# EAGLE design booster002 (EAGLE 4.16)
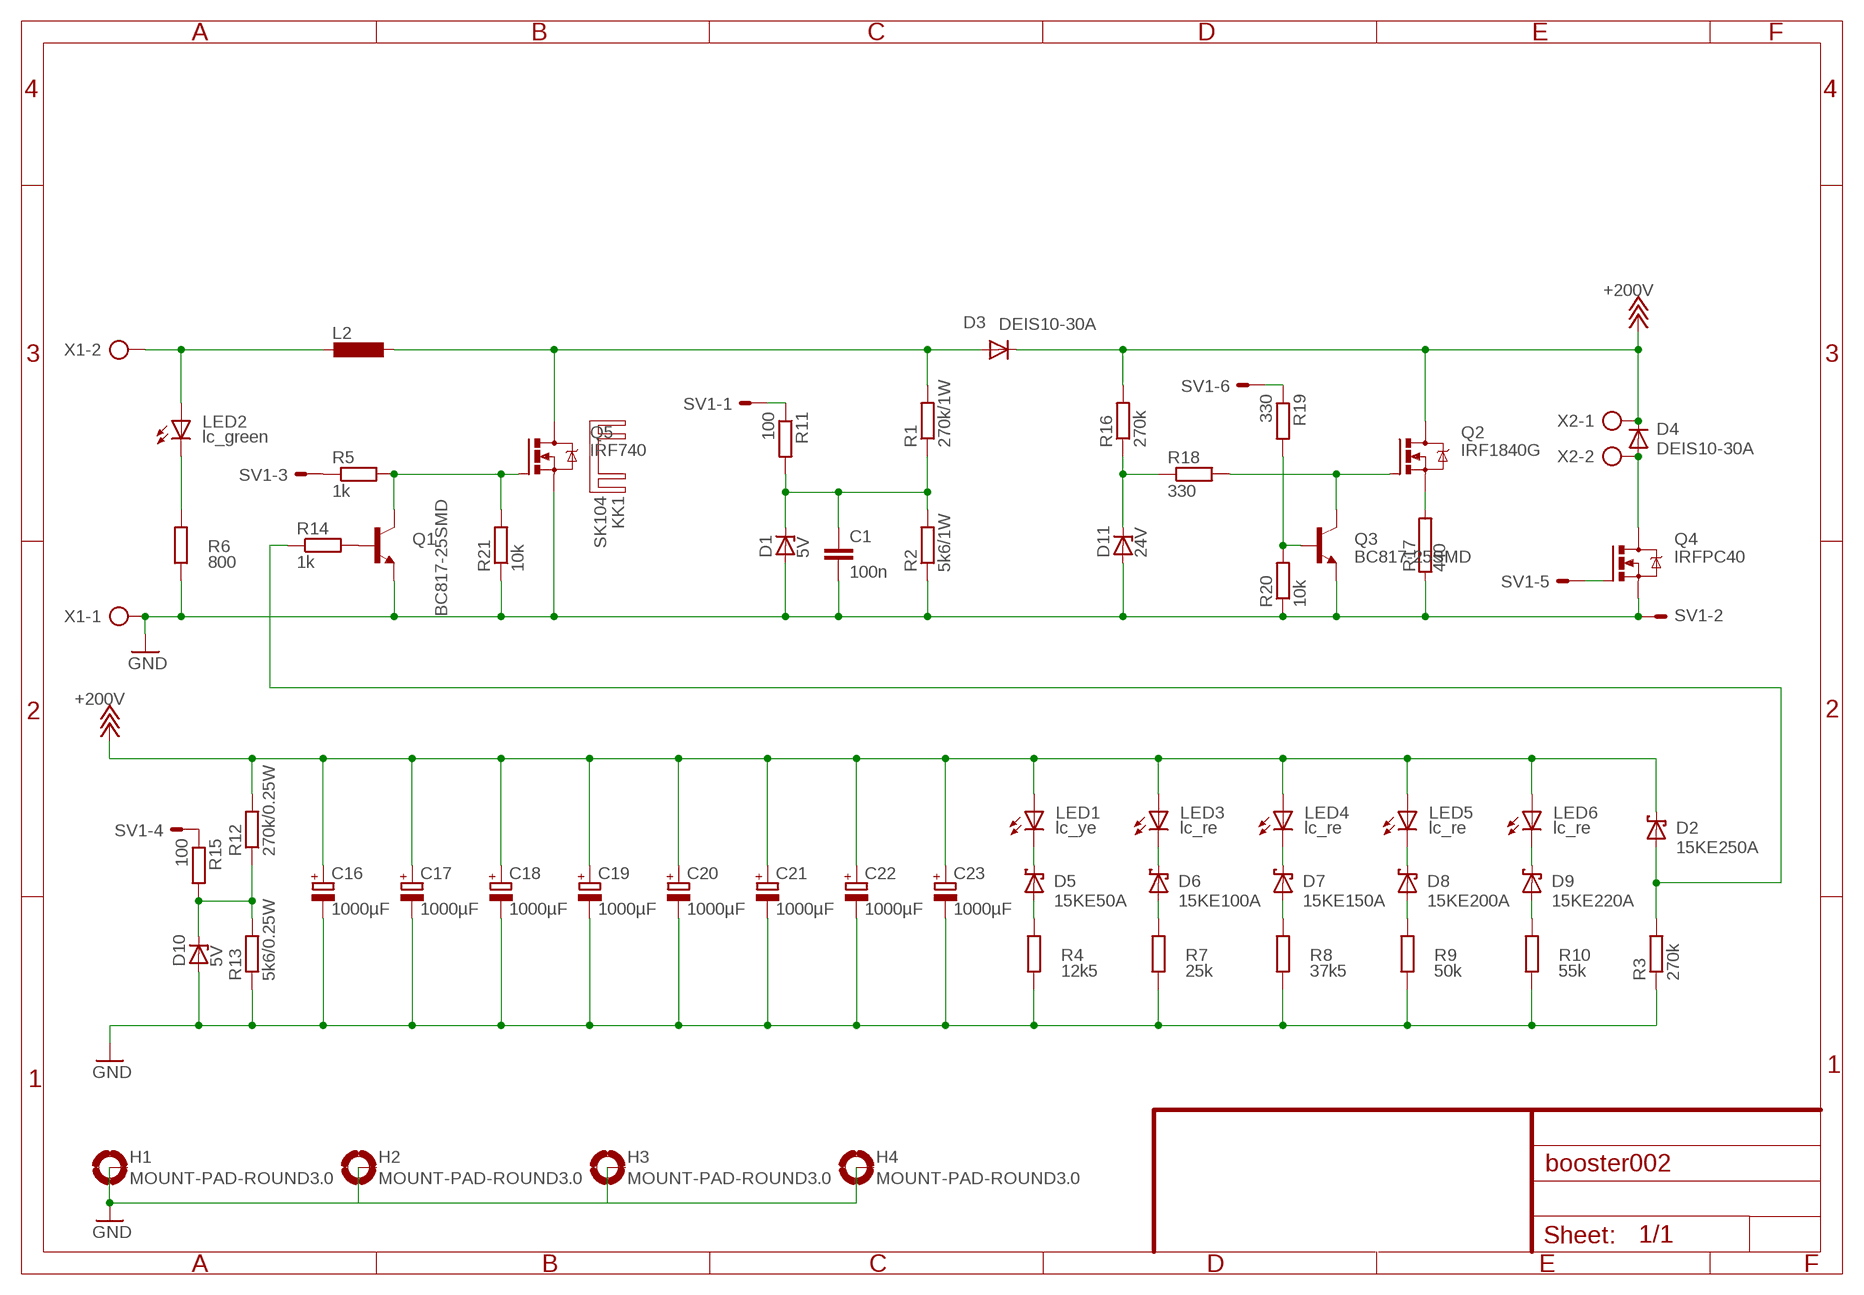
[diagram p0: schematic, sheet 1]

## Parts
C1  100n  C-EUC0603  [C0603]
C16  1000µF  CPOL-EUE10-35  [EB35D]
C17  1000µF  CPOL-EUE10-35  [EB35D]
C18  1000µF  CPOL-EUE10-35  [EB35D]
C19  1000µF  CPOL-EUE10-35  [EB35D]
C20  1000µF  CPOL-EUE10-35  [EB35D]
C21  1000µF  CPOL-EUE10-35  [EB35D]
C22  1000µF  CPOL-EUE10-35  [EB35D]
C23  1000µF  CPOL-EUE10-35  [EB35D]
D1  5V  ZENER-DIODESOT23  [SOT23]
D2  15KE250A  15KEXX  [CB429-17]
D3  DEIS10-30A  [TO247AD]
D4  DEIS10-30A  [TO247AD]
D5  15KE50A  15KEXX  [CB429-17]
D6  15KE100A  15KEXX  [CB429-17]
D7  15KE150A  15KEXX  [CB429-17]
D8  15KE200A  15KEXX  [CB429-17]
D9  15KE220A  15KEXX  [CB429-17]
D10  5V  ZENER-DIODESOT23  [SOT23]
D11  24V  ZENER-DIODESOT23  [SOT23]
H1  MOUNT-PAD-ROUND3.0  [3,0-PAD]
H2  MOUNT-PAD-ROUND3.0  [3,0-PAD]
H3  MOUNT-PAD-ROUND3.0  [3,0-PAD]
H4  MOUNT-PAD-ROUND3.0  [3,0-PAD]
KK1  SK104  [SK104]
L2  L-EUTJ6-U1  [TJ6-U1]
LED1  lc_ye  LED5MM  [LED5MM]
LED2  lc_green  LED5MM  [LED5MM]
LED3  lc_re  LED5MM  [LED5MM]
LED4  lc_re  LED5MM  [LED5MM]
LED5  lc_re  LED5MM  [LED5MM]
LED6  lc_re  LED5MM  [LED5MM]
Q1  BC817-25SMD  [SOT23-BEC]
Q2  IRF1840G  IRF740  [TO220BV]
Q3  BC817-25SMD  [SOT23-BEC]
Q4  IRFPC40  [TO247BV]
Q5  IRF740  [TO220BV]
R1  270k/1W  R-EU_0207/10  [0207/10]
R2  5k6/1W  R-EU_0207/10  [0207/10]
R3  270k  R-EU_R0805  [R0805]
R4  12k5  R-EU_R0805  [R0805]
R5  1k  R-EU_R0805  [R0805]
R6  800  R-EU_R0805  [R0805]
R7  25k  R-EU_R0805  [R0805]
R8  37k5  R-EU_R0805  [R0805]
R9  50k  R-EU_R0805  [R0805]
R10  55k  R-EU_R0805  [R0805]
R11  100  R-EU_R0805  [R0805]
R12  270k/0.25W  R-EU_0207/10  [0207/10]
R13  5k6/0.25W  R-EU_0207/10  [0207/10]
R14  1k  R-EU_R0805  [R0805]
R15  100  R-EU_R0805  [R0805]
R16  270k  R-EU_R0805  [R0805]
R17  440  RHS50  [HS50]
R18  330  R-EU_R0805  [R0805]
R19  330  R-EU_R0805  [R0805]
R20  10k  R-EU_R0805  [R0805]
R21  10k  R-EU_R0805  [R0805]
SV1  ML6LE  [ML6L]
X1  AK500/2-H  [AK500/2-H]
X2  AK500/2-H  [AK500/2-H]

## Nets
+200V: C16.+ C17.+ C18.+ C19.+ C20.+ C21.+ C22.+ C23.+ D2.C D3.K(C) D4.K(C) LED1.A LED3.A LED4.A LED5.A LED6.A Q2.D R12.2 R16.2 X2.1
ADC_250V: C1.1 D1.3(C) R1.1 R2.2 R11.2
ADC_250V1: D10.3(C) R12.1 R13.2 R15.2
GND [Power]: C1.2 C16.- C17.- C18.- C19.- C20.- C21.- C22.- C23.- D1.1(A) D10.1(A) D11.1(A) H1.B3,0(MOUNT) H2.B3,0(MOUNT) H3.B3,0(MOUNT) H4.B3,0(MOUNT) Q1.E Q3.E Q4.S Q5.S R2.1 R3.1 R4.1 R6.1 R7.1 R8.1 R9.1 R10.1 R13.1 R17.1 R20.1 R21.1 SV1.2 X1.1
N$1: R5.1 SV1.3
N$2: Q4.G SV1.5
N$3: D5.A R4.2
N$4: D2.A R3.2 R14.1
N$5 [Power]: D4.A Q4.D X2.2
N$6: D5.C LED1.K(C)
N$7: LED2.K(C) R6.2
N$8: D6.A R7.2
N$9: D6.C LED3.K(C)
N$10: D7.A R8.2
N$11: D7.C LED4.K(C)
N$12: D8.A R9.2
N$13: D8.C LED5.K(C)
N$14: D9.A R10.2
N$15: D9.C LED6.K(C)
N$16: R11.1 SV1.1
N$17: R15.1 SV1.4
N$18: Q2.G Q3.C R18.2
N$19: Q2.S R17.2
N$20: D11.3(C) R16.1 R18.1
N$21: Q3.B R19.2 R20.2
N$22 [Power]: L2.2 LED2.A X1.2
N$23: Q1.B R14.2
N$24: R19.1 SV1.6
N$29: Q1.C Q5.G R5.2 R21.2
N$32 [Power]: D3.A L2.1 Q5.D R1.2

## Library data of the parts
C1 = rcl:C-EU: CAPACITOR, European symbol
C16-C23 = rcl:CPOL-EU: POLARIZED CAPACITOR, European symbol
D1 D10 D11 = diode:ZENER-DIODE: Z-Diode
D2 D5-D9 = diode:15KEXX: DIODE
D3 D4 = carpenoctem:DEIS10-30A
H1-H4 = holes:MOUNT-PAD-ROUND: MOUNTING PAD, round
KK1 = heatsink:SK104: HEATSINK manufacturer Fischer/distributor Buerklin
L2 = rcl:L-EU: INDUCTOR, European symbol
LED1-LED6 = led:LED: LED OSRAM: - CHIPLED LG R971, LG N971, LY N971, LG Q971, LY Q971, LO R971, LY R971 LH N974, LH R974 LS Q976, LO Q976, LY Q976 LO Q996 - Hyper CHIPLED LW Q18S LB Q993, LB Q99A, LB R99A - SideLED LS A670, LO A670, LY A670, LG A670, LP A670 LB A673, LV A673, LT A673, LW A673 LH A674 LY A675 LS A676, LA A676, LO A676, LY A676, LW A676 LS A679, LY A679, LG A679 - Hyper Micro SIDELED® LS Y876, LA Y876, LO Y876, LY Y876 LT Y87S - SmartLED LW L88C, LW L88S LB L89C, LB L89S, LG L890 LS L89K, LO L89K, LY L89K LS L896, LA L896, LO L896, LY L896 - TOPLED LS T670, LO T670, LY T670, LG T670, LP T670 LSG T670, LSP T670, LSY T670, LOP T670, LYG T670 LG T671, LOG T671, LSG T671 LB T673, LV T673, LT T673, LW T673 LH T674 LS T676, LA T676, LO T676, LY T676, LB T676, LH T676, LSB T676, LW T676 LB T67C, LV T67C, LT T67C, LS T67K, LO T67K, LY T67K, LW E67C LS E67B, LA E67B, LO E67B, LY E67B, LB E67C, LV E67C, LT E67C LW T67C LS T679, LY T679, LG T679 LS T770, LO T770, LY T770, LG T770, LP T770 LB T773, LV T773, LT T773, LW T773 LH T774 LS E675, LA E675, LY E675, LS T675 LS T776, LA T776, LO T776, LY T776, LB T776 LHGB T686 LT T68C, LB T68C - Hyper Mini TOPLED® LB M676 - Mini TOPLED Santana® LG M470 LS M47K, LO M47K, LY M47K Source: http://www.osram.convergy.de - LUMILED® LXK2-PW12-R00, LXK2-PW12-S00, LXK2-PW14-U00, LXK2-PW14-V00 LXK2-PM12-R00, LXK2-PM12-S00, LXK2-PM14-U00 LXK2-PE12-Q00, LXK2-PE12-R00, LXK2-PE12-S00, LXK2-PE14-T00, LXK2-PE14-U00 LXK2-PB12-K00, LXK2-PB12-L00, LXK2-PB12-M00, LXK2-PB14-N00, LXK2-PB14-P00, LXK2-PB14-Q00 LXK2-PR12-L00, LXK2-PR12-M00, LXK2-PR14-Q00, LXK2-PR14-R00 LXK2-PD12-Q00, LXK2-PD12-R00, LXK2-PD12-S00 LXK2-PH12-R00, LXK2-PH12-S00 LXK2-PL12-P00, LXK2-PL12-Q00, LXK2-PL12-R00 Source: www.luxeon.com
Q1 Q3 = transistor-npn:BC817*: NPN Transistor
Q2 Q5 = transistor-power:IRF740: N-CHANNEL MOS FET
Q4 = transistor-power:IRFPC40: N-CHANNEL MOS FET
R1-R16 R18-R21 = rcl:R-EU_: RESISTOR, European symbol
R17 = resistor-power:R: Power Resitor
SV1 = con-harting-ml:ML6?E: HARTING
X1 X2 = con-ptr500:AK500/2-H: CONNECTOR Aug. 2004 / PTR Meßtechnik: Die Bezeichnung der Serie AK505 wurde geändert. Es handelt sich hierbei um AK500 in horizontaler Ausführung.

## Net classes
1 Power: width 0.406 mm
2 High Power: width 2 mm

## Board
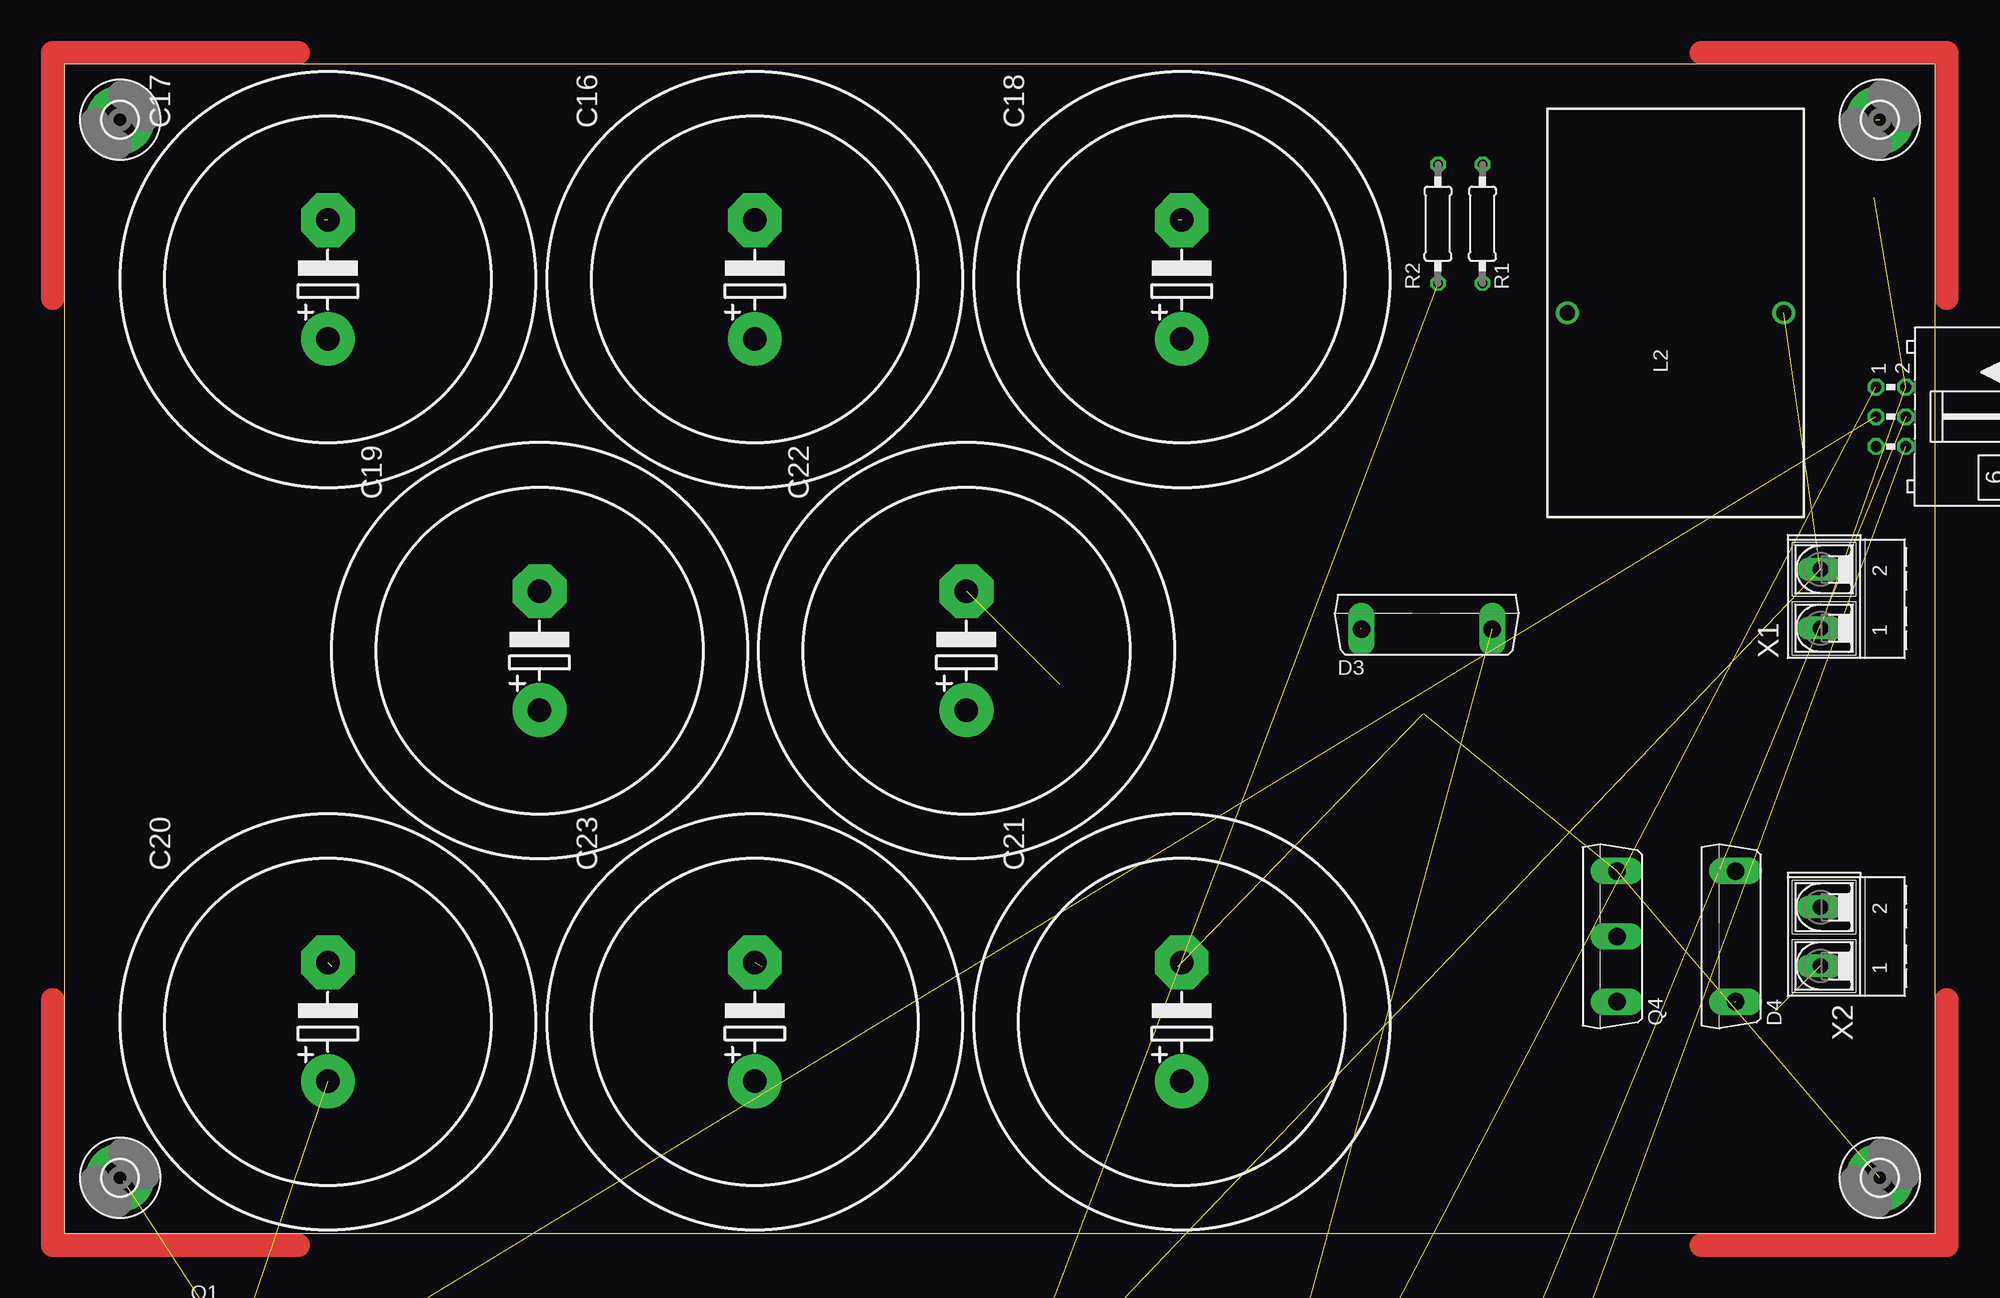
[diagram p1: board, top side]
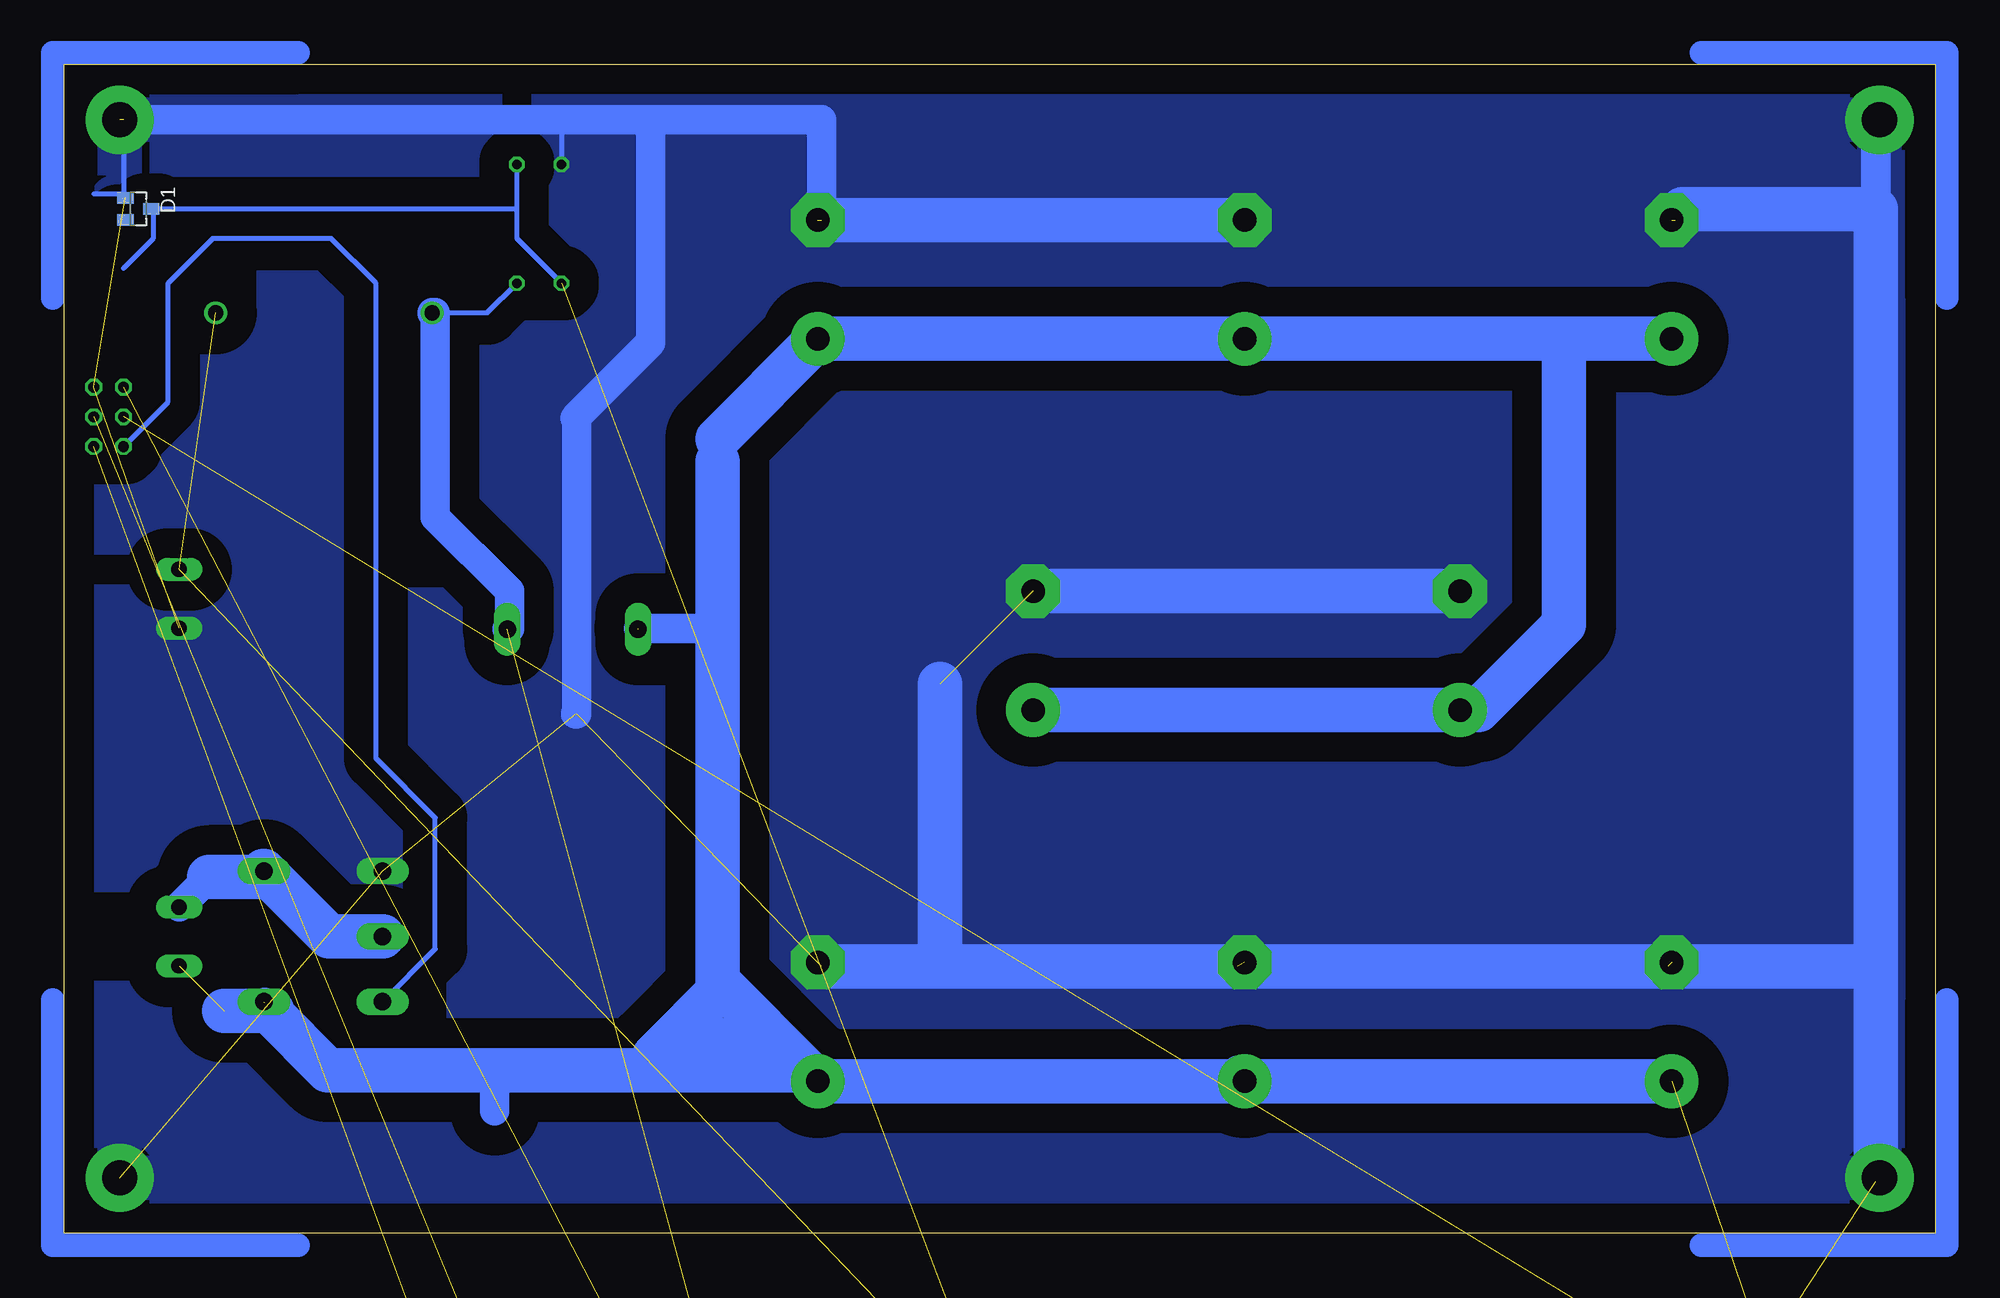
[diagram p2: board, bottom side, seen from below]

Size 160 x 100 mm. Coordinates in mm from the lower left corner, seen from the top.
Outline: 0,0 160,0 160,100 0,100 0,0
Copper layers (1*16): Top 0.035mm / dielectric 1.5mm / Bottom 0.035mm
Design rules "olimex_10mils": minimum track width 10mil, minimum drill 24mil, track to track 10mil, track to pad 10mil, pad to pad 10mil, via to via 10mil, smd to smd 10mil, copper to edge 40mil, drill to drill 10mil, minimum pad ring 10mil, minimum via ring 8mil, stop-mask expansion 0mil, vias tented up to drill 0mil, thermal gap 10mil

### Footprints (pad centres in the part's own frame; a part is rotated, then mirrored left to right if it is on the bottom)
C0603 = smd 1.1 x 1: 1 -0.85,0; 2 0.85,0
EB35D = drill 2.007 pad 4.597 round: + -5.08,0 | drill 2.007 pad 4.597 octagon: - 5.08,0
SOT23 = smd 1 x 1.4: 1 -0.95,-1.1; 2 0.95,-1.1; 3 0,1.1
CB429-17 = drill 1.397 long: A 8.89,0; C -8.89,0
TO247AD = drill 1.499 long: A 5.588,-0.381; K -5.588,-0.381
3,0-PAD = drill 3 pad 5.842 round: B3,0 0,0
SK104 = drill 2.54 pad 5.08 round: A2,5 -12.7,-0.762; B2,5 12.7,-0.762
TJ6-U1 = drill 1.3 round: 1 -9.25,0; 2 9.25,0
LED5MM = drill 0.813 octagon: A -1.27,0; K 1.27,0
SOT23-BEC = smd 1 x 1.4: B -0.95,-1.1; C 0,1.1; E 0.95,-1.1
TO220BV = drill 1.016 long: D 0,-2.54; G -2.54,-2.54; S 2.54,-2.54
TO247BV = drill 1.499 long: D 0,-2.921; G -5.588,-2.921; S 5.588,-2.921
0207/10 = drill 0.813 octagon: 1 -5.08,0; 2 5.08,0
R0805 = smd 1.3 x 1.5: 1 -0.85,0; 2 0.85,0
HS50 = drill 1.3 octagon: 1 -31.47,0; 2 31.47,0 | hole 3.2: 19.85,10.7; -19.85,-10.7
ML6L = drill 0.914 octagon: 1 -2.54,-1.27; 2 -2.54,1.27; 3 0,-1.27; 4 0,1.27; 5 2.54,-1.27; 6 2.54,1.27
AK500/2-H = drill 1.321 long: 1 -2.515,0; 2 2.515,0

### Placement (x,y rotation side)
C1  1.27,-231.14 0 top  (outside the outline)
C16  59.05,81.6 90 top
C17  22.54,81.6 90 top
C18  95.57,81.6 90 top
C19  40.64,49.85 90 top
C20  22.54,18.1 90 top
C21  95.57,18.1 90 top
C22  77.15,49.85 90 top
C23  59.05,18.1 90 top
D1  153.67,87.63 270 bottom
D2  10.16,-49.53 0 top  (outside the outline)
D3  116.52,52.07 0 top
D4  142.56,25.4 90 top
D5  10.16,-58.42 0 top  (outside the outline)
D6  36.83,-120.65 0 top  (outside the outline)
D7  36.83,-149.86 0 top  (outside the outline)
D8  36.83,-179.07 0 top  (outside the outline)
D9  36.83,-208.28 0 top  (outside the outline)
D10  39.37,-238.76 0 top  (outside the outline)
D11  1.27,-274.32 0 top  (outside the outline)
H1  4.76,4.76 0 top
H2  4.76,95.25 0 top
H3  155.26,95.25 0 top
H4  155.26,4.76 0 top
KK1  15.24,-394.97 0 top  (outside the outline)
L2  137.79,78.74 0 top
LED1  5.08,-76.2 0 top  (outside the outline)
LED2  5.08,-96.52 0 top  (outside the outline)
LED3  30.48,-109.22 0 top  (outside the outline)
LED4  30.48,-138.43 0 top  (outside the outline)
LED5  30.48,-167.64 0 top  (outside the outline)
LED6  30.48,-196.85 0 top  (outside the outline)
Q1  12.7,-7.62 0 top  (outside the outline)
Q2  3.81,-403.86 0 top  (outside the outline)
Q3  1.27,-344.17 0 top  (outside the outline)
Q4  129.86,25.4 90 top
Q5  3.81,-381 0 top  (outside the outline)
R1  121.28,86.36 270 top
R2  117.47,86.36 270 top
R3  1.27,-375.92 0 top  (outside the outline)
R4  1.27,-66.04 0 top  (outside the outline)
R5  1.27,-24.13 0 top  (outside the outline)
R6  1.27,-86.36 0 top  (outside the outline)
R7  27.94,-128.27 0 top  (outside the outline)
R8  27.94,-157.48 0 top  (outside the outline)
R9  27.94,-186.69 0 top  (outside the outline)
R10  27.94,-215.9 0 top  (outside the outline)
R11  1.27,-223.52 0 top  (outside the outline)
R12  24.13,-257.81 0 top  (outside the outline)
R13  41.91,-257.81 0 top  (outside the outline)
R14  12.7,-16.51 0 top  (outside the outline)
R15  20.32,-265.43 0 top  (outside the outline)
R16  1.27,-283.21 0 top  (outside the outline)
R17  33.02,-316.23 0 top  (outside the outline)
R18  1.27,-353.06 0 top  (outside the outline)
R19  1.27,-360.68 0 top  (outside the outline)
R20  1.27,-368.3 0 top  (outside the outline)
R21  1.27,-415.29 0 top  (outside the outline)
SV1  156.21,69.85 270 top
X1  150.18,54.29 90 top
X2  150.18,25.4 90 top

### Tracks (layer width: path | path; a pad name or v marks a point on that pad's centre or on a via)
+200V  (12 unrouted)
  Bottom 2.54: 142.88,19.75 142.88,19.68 143.06,19.68 143.19,19.68 142.4,18.89 142.24,19.05 | 59.69,76.52 C16.+ 59.05,76.83 | 59.69,76.52 59.69,76.83 | 59.69,76.52 59.69,76.2 | 39.05,44.77 C19.+ 40.64,44.45 40.96,44.77 | 58.74,13.02 58.42,13.02 58.42,12.7 58.74,13.02 | 58.74,13.02 59.69,13.97 59.69,12.7 | 103.66,21.11 104.14,21.59 | 104.14,67.94 104.14,66.04 104.14,66.17 | C18.+ 95.89,76.2 | 58.74,13.02 C23.+ | 104.14,51.75 110.87,51.75 | 142.24,19.05 | 103.66,21.11 103.5,21.27 | 103.66,21.11 | 123.19,13.97 123.19,10.48
  Bottom 3.81: 31.75,76.52 C17.+ | 31.75,76.52 C16.+ C18.+ 104.14,67.94 | 39.05,44.77 31.75,52.07 31.75,76.52 | 40.96,44.77 C22.+ | C20.+ 58.42,13.02 | C23.+ C21.+ 96.52,13.97 | 96.52,13.97 103.66,21.11 109.54,15.24 | 104.14,21.59 104.14,51.75 104.14,66.04 | 142.24,19.05 146.34,19.05 | 96.52,13.97 107.95,13.97 | 107.95,13.97 109.22,15.24 | 100.33,16.51 105.41,16.51 107.95,13.97 | 142.4,18.89 137.48,13.97 123.19,13.97 107.95,13.97
ADC_250V  (2 unrouted)
  Bottom 0.406: D1.3 152.4,87.46 | 152.4,87.63 152.72,87.31 | D1.3 152.72,87.63 | R2.2 121.28,85.09 121.28,87.63 | 121.28,87.63 R1.1 | 121.28,87.63 152.4,87.63 | 154.94,82.55 152.4,85.09 152.4,87.63 | 152.4,87.63 D1.3
ADC_250V1  (3 unrouted)
GND  (29 unrouted)
  Bottom 0.406: 154.94,95.25 154.94,88.9 | 154.94,88.9 154.94,88.75 D1.1 | 154.94,88.9 157.48,88.9 | 117.47,95.25 R2.1
  Bottom 2.54: 95.25,86.36 95.25,86.68 95.25,95.25 109.86,95.25 | 109.86,95.25 117.47,95.25 154.94,95.25 | 109.86,95.25 109.86,76.2 116.33,69.72 116.2,69.6 116.2,44.45 116.27,44.45 | 22.23,86.68 22.23,87 21.59,87.63 | H2.B3,0 5.08,95.25 5.08,87.63 | H1.B3,0 5.08,5.08 | H1.B3,0 5.08,4.45 | 59.69,22.86 59.69,22.54 | H1.B3,0 4.45,4.76 | C18.- 95.89,86.68 95.89,86.36 | C22.- 76.83,54.61
  Bottom 3.81: 85.09,22.86 59.69,22.86 22.86,22.86 5.08,22.86 | 85.09,22.86 95.25,22.86 | 85.09,22.86 85.09,46.99 | 5.08,5.08 5.08,22.86 | 5.08,22.86 5.08,87.63 21.59,87.63 | C16.- C18.- | C19.- C22.-
  pour Bottom (isolate 2.54): -1.27,100.33 161.29,100.33 161.29,-1.27 -1.27,-1.27
N$1  (1 unrouted)
N$2
  Bottom 0.406: 132.72,19.75 Q4.G 128.27,24.32 128.27,35.56 133.35,40.64 133.35,81.28 137.16,85.09 147.32,85.09 151.13,81.28 151.13,71.12 SV1.5
N$3  (1 unrouted)
N$4  (2 unrouted)
N$5
  Bottom 2.54: 147.61,30.48 X2.2 | 142.24,30.48 143.51,30.48 143.45,30.48 D4.A
  Bottom 3.81: 143.51,30.48 147.61,30.48 | D4.A 137.35,25.4 Q4.D
N$6  (1 unrouted)
N$7  (1 unrouted)
N$8  (1 unrouted)
N$9  (1 unrouted)
N$10  (1 unrouted)
N$11  (1 unrouted)
N$12  (1 unrouted)
N$13  (1 unrouted)
N$14  (1 unrouted)
N$15  (1 unrouted)
N$16  (1 unrouted)
N$17  (1 unrouted)
N$18  (2 unrouted)
N$19  (1 unrouted)
N$20  (2 unrouted)
N$21  (2 unrouted)
N$22  (2 unrouted)
N$23  (1 unrouted)
N$24  (1 unrouted)
N$29  (3 unrouted)
N$32  (1 unrouted)
  Bottom 0.406: R1.2 123.83,78.74 128.27,78.74
  Bottom 2.54: 128.27,78.42 128.27,77.34 | 128.27,78.42 128.27,78.74 L2.1 128.54,78.7 128.27,78.42 | 128.27,78.42 128.27,61.28 121.92,54.93 121.92,51.75 122.05,51.75 D3.A
S$1
  Top 2: 20,-1 -1,-1 -1,20
S$2
  Top 2: 140,-1 161,-1 161,20
S$3
  Top 2: 20,101 -1,101 -1,80
S$4
  Top 2: 161,80 161,101 140,101
S$5
  Bottom 2: 20,-1 -1,-1 -1,20
S$6
  Bottom 2: 140,-1 161,-1 161,20
S$7
  Bottom 2: 20,101 -1,101 -1,80
S$8
  Bottom 2: 161,80 161,101 140,101